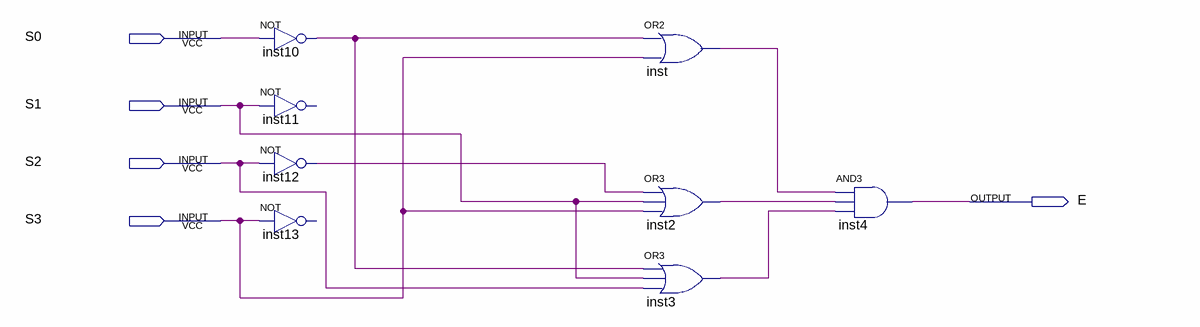
[diagram p0: schematic sheet]
// Quartus schematic E-nda2_3.bdf as structural Verilog: 8 symbols, 5 pins
module \E-nda2_3  (
  input  S0,
  input  S1,
  input  S2,
  input  S3,
  output E
);

  wire inst2_out, inst3_out, inst10_out, inst12_out, inst_out;

  not inst10 (inst10_out, S0);
  // NOT inst11 has open pins: IN=S1, OUT=open
  not inst12 (inst12_out, S2);
  // NOT inst13 has open pins: IN=S3, OUT=open
  or inst (inst_out, inst10_out, S3);
  or inst2 (inst2_out, inst12_out, S1, S3);
  or inst3 (inst3_out, inst10_out, S1, S2);
  and inst4 (E, inst_out, inst2_out, inst3_out);
endmodule
